# Altium schematic sheet 2020年电赛校赛测量、基准板.SchDoc
size A4
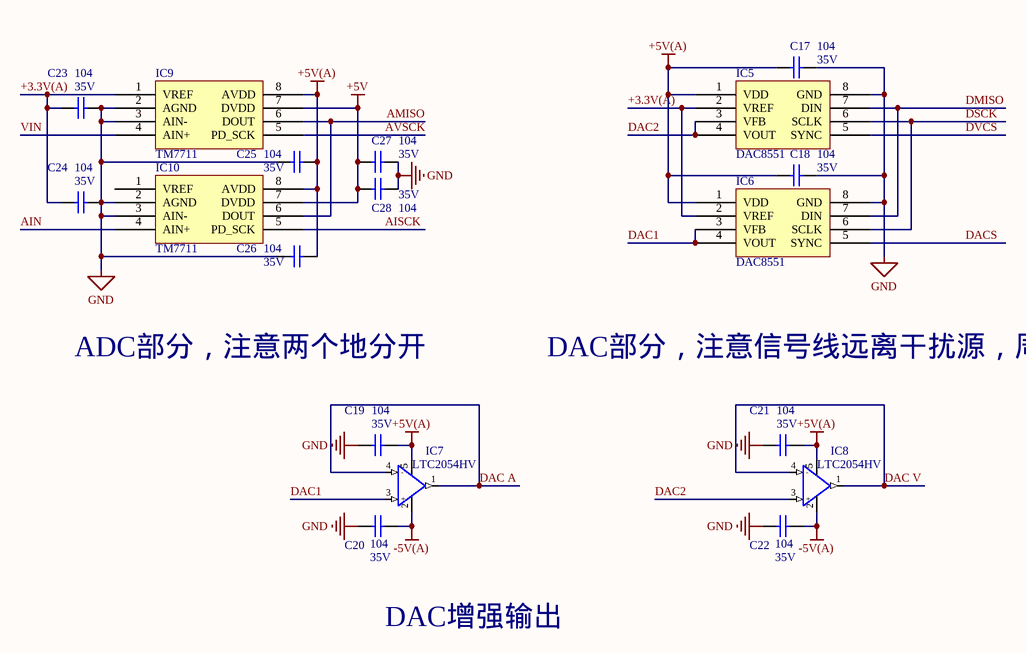
[diagram p0: 2020年电赛校赛测量、基准板.SchDoc]

## Parts
C17  104  value 35V  [C0805]
C18  104  value 35V  [C0805]
C19  104  value 35V  [C0805]
C20  104  value 35V  [C0805]
C21  104  value 35V  [C0805]
C22  104  value 35V  [C0805]
C23  104  value 35V  [C0805]
C24  104  value 35V  [C0805]
C25  104  value 35V  [C0805]
C26  104  value 35V  [C0805]
C27  104  value 35V  [C0805]
C28  104  value 35V  [C0805]
IC5  DAC8551  [MSOP-8]
IC6  DAC8551  [MSOP-8]
IC7  LTC2054HV  [TSOT-32-5]
IC8  LTC2054HV  [TSOT-32-5]
IC9  TM7711  [SOP-8(体宽3.8mm)]
IC10  TM7711  [SOP-8(体宽3.8mm)]

## Nets
+5V: C27.1 C28.1 IC9.7(DVDD) IC10.7(DVDD)
+5V(A): C17.1 C18.1 C19.2 C21.2 C25.2 C26.2 IC5.1(VDD) IC6.1(VDD) IC7.5 IC8.5 IC9.8(AVDD) IC10.8(AVDD)
-5V(A): C20.2 C22.2 IC7.2 IC8.2
GND: C17.2 C18.2 C19.1 C20.1 C21.1 C22.1 C23.2 C24.2 C25.1 C26.1 C27.2 C28.2 IC5.8(GND) IC6.8(GND) IC9.2(AGND) IC9.3(AIN-) IC10.2(AGND) IC10.3(AIN-)
+3.3V(A): C23.1 C24.1 IC5.2(VREF) IC6.2(VREF) IC9.1(VREF)
AIN: IC10.4(AIN+)
AISCK: IC10.5(PD_SCK)
AMISO: IC9.6(DOUT) IC10.6(DOUT)
AVSCK: IC9.5(PD_SCK)
DAC1: IC6.3(VFB) IC6.4(VOUT) IC7.3(+)
DAC2: IC5.3(VFB) IC5.4(VOUT) IC8.3(+)
DAC A: IC7.1 IC7.4(-)
DAC V: IC8.1 IC8.4(-)
DACS: IC6.5(SYNC)
DMISO: IC5.7(DIN) IC6.7(DIN)
DSCK: IC5.6(SCLK) IC6.6(SCLK)
DVCS: IC5.5(SYNC)
VIN: IC9.4(AIN+)

Not connected (* = marked no-connect by the designer): IC10 1(VREF)

## Notes on the sheet
- ADC部分，注意两个地分开
- DAC部分，注意信号线远离干扰源，周围围模拟地
- DAC增强输出

## Library data of the parts
C17-C28 = 104: 无极性电容
IC7 IC8 = OPA350UA: 运放